# Altium project Assembly_robot.PrjPcb
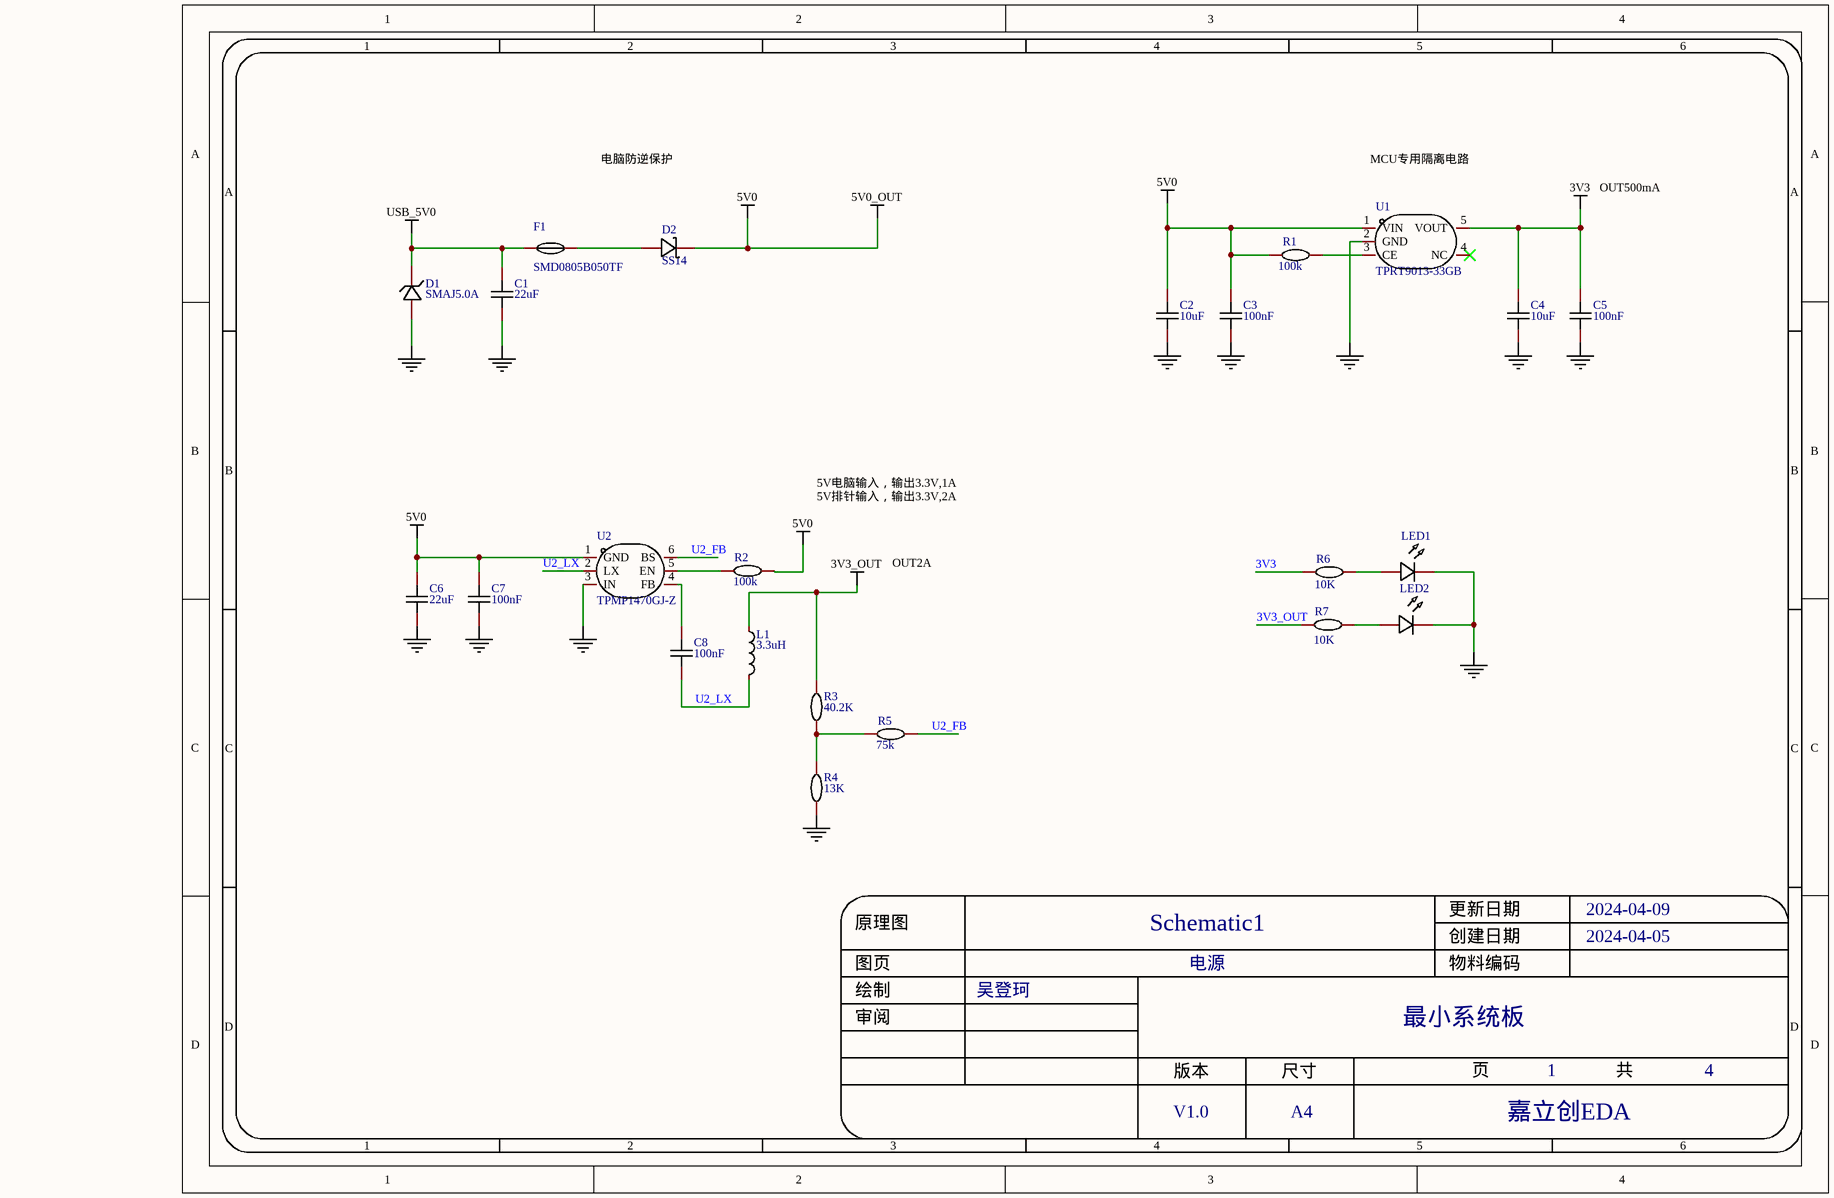
[diagram p0: 1_电源.schdoc.schdoc]
4 sheets, 130 parts. Net scope: global (net labels, ports and power ports of the same name join across sheets).
Sheets:
  1_电源.schdoc.schdoc
  2_MCU.schdoc.schdoc
  3_外设.schdoc.schdoc
  4_接口.schdoc.schdoc

## Sheet 1_电源.schdoc.schdoc
size 309 x 223 mm; Symbol: Sheet-Symbol_A4; Device: Sheet-Symbol_A4; Company: 嘉立创EDA; Drawed: 吴登珂; Version: V1.0; Page Size: A4; @Project Name: 最小系统板; @Page Count: 4; @Update Date: 2024-04-09; @Create Date: 2024-04-05; @Schematic Name: Schematic1; @Page No: 1; @Page Name: 电源

### Parts
C1  22uF  [C1206]
C2  10uF  [C0603]
C3  100nF  [C0603]
C4  10uF  [C0603]
C5  100nF  [C0603]
C6  22uF  [C1206]
C7  100nF  [C0603]
C8  100nF  [C0603]
D1  SMAJ5.0A  [SMA_L4.4-W2.8-LS5.4-RD]
D2  SS14  [SMA_L4.3-W2.6-LS5.2-RD]
F1  SMD0805B050TF  [F0805]
L1  3.3uH  [IND-SMD_L7.3-W6.6]
LED1  LED_0603-R  [LED_0603]  (value not drawn)
LED2  LED_0603-R  [LED_0603]  (value not drawn)
R1  100k  [R0603]
R2  100k  [R0603]
R3  40.2K  [R0603]
R4  13K  [R0603]
R5  75k  [R0603]
R6  10K  [R0603]
R7  10K  [R0603]
U1  TPRT9013-33GB  [SOT-23-5_L3.0-W1.7-P0.95-LS2.8-BL]
U2  TPMP1470GJ-Z  [SOT-23-6_L2.9-W1.6-P0.95-LS2.8-BL]

### Nets
3V3: C4.2 C5.2 R6.1 U1.5(VOUT)
3V3_OUT: L1.1 R3.2 R7.1
5V0: C2.2 C3.2 C6.2 C7.2 D2.1(K) R1.1 R2.2 U1.1(VIN) U2.1(GND)  [also labelled 5V0_OUT]
NetBT1_2: C1.1 C2.1 C3.1 C4.1 C5.1 C6.1 C7.1 D1.2(A) LED1.1(C) LED2.1(C) R4.1 U1.2(GND) U2.3(IN)
USB_5V0: C1.2 D1.1(C) F1.1
U2_FB: R5.2 U2.6(BS)
U2_LX: C8.2 L1.2 U2.2(LX)
NetC8_1: C8.1 U2.4(FB)
NetD2_2: D2.2(A) F1.2
NetLED1_2: LED1.2(A) R6.2
NetLED2_2: LED2.2(A) R7.2
NetR1_2: R1.2 U1.3(CE)
NetR2_1: R2.1 U2.5(EN)
NetR3_1: R3.1 R4.2 R5.1

Not connected (* = marked no-connect by the designer): U1 4(NC)*

### Notes on the sheet
- 电脑防逆保护
- MCU专用隔离电路
- OUT500mA
- 5V电脑输入，输出3.3V,1A
- 5V排针输入，输出3.3V,2A
- OUT2A
- 1
- 2
- 3
- 4
- 5
- 6
- A
- B
- C
- 原理图
- Schematic1
- 创建日期
- 更新日期
- 2024-04-09
- 2024-04-05
- 审阅
- 绘制
- 图页
- 吴登珂
- 电源
- 物料编码
- 最小系统板
- D
- 版本
- 尺寸
- 页
- 共
- V1.0
- A4
- 嘉立创EDA

### Library data of the parts
C1 C6 = CAP_1206: Symbol: CapAcitance; Convert to PCB: yes; Name: 22uF; Device: CAP_1206; Add into BOM: yes; Supplier Footprint: 1206; Value: 22uF
C2-C5 C7 C8 = CAP_0603: Symbol: CapAcitance; Convert to PCB: yes; Device: CAP_0603; Add into BOM: yes; Supplier Footprint: 0603
  C2 C4: Name: 10uF; Value: 10uF
  C3 C5 C7 C8: Name: 100nF; Value: 100nF
D1 = SMAJ5.0A_C353442: Manufacturer: 晶导微电子; Add into BOM: yes; Reverse Stand-Off Voltage (Vrwm): 5V; Maximum Clamping Voltage: 9.2V; Peak Pulse Current (Ipp)@10/1000us: 43.5A; Peak Pulse Power Dissipation (Ppp)@10/1000us: 400W; Breakdown Voltage: 6.4V; Reverse Leakage Current (Ir): 800uA; Type: TVS; Name: SMAJ5.0A; Symbol: SMAJ5.0A_C353442; Device: SMAJ5.0A_C353442; LCSC Part Name: 单向TVS 5V截止 43.5A峰值脉冲; Supplier Part: C353442; Manufacturer Part: SMAJ5.0A; Supplier Footprint: SMA; JLCPCB Part Class: 扩展库; Datasheet: https://atta.szlcsc.com/upload/public/pdf/source/20190103/C353498_9C52E1B7CA7D9691073072057BB1DA1A.pdf; Supplier: LCSC; Convert to PCB: yes
D2 = SS14_C83852: Manufacturer: onsemi(安森美); Add into BOM: yes; Forward Voltage (Vf@If): 500mV@1A; Reverse Voltage (Vr): 40V; Average Rectified Current (Io): 1A; Reverse Leakage Current (Ir): 200uA@40V; Name: SS14; Symbol: SS14_C83852; Device: SS14_C83852; Supplier: LCSC; Supplier Part: C83852; Manufacturer Part: SS14; JLCPCB Part Class: 扩展库; LCSC Part Name: 电压:40V 电流:1A; Supplier Footprint: SMA(DO-214AC); Datasheet: https://atta.szlcsc.com/upload/public/pdf/source/20181222/C83852_041FE29A925F1DAA7D9CB1F1C69076C2.pdf; Convert to PCB: yes
F1 = SMD0805B050TF: Manufacturer: Brightking(君耀电子); Add into BOM: yes; Operating Voltage (Max): 6V; Current Rating (Max): 100A; Hold Current: 500mA; Trip Current: 1A; Resistance - Initial (Ri) (Min): 150mΩ; Maximum Time to Trip: 100ms; Name: SMD0805B050TF; Symbol: SMD0805B050TF; Device: SMD0805B050TF; LCSC Part Name: 6V 500mA 0805自恢复; Supplier Part: C269104; Manufacturer Part: SMD0805B050TF; Supplier Footprint: 0805; JLCPCB Part Class: 扩展库; Datasheet: https://atta.szlcsc.com/upload/public/pdf/source/20180913/C269107_1BF28CF6F4C5BFD5B8CD673BC8D2B923.pdf; Supplier: LCSC; Convert to PCB: yes; Operating Temperature: -40℃~+85℃；-40℃~+85℃；-40℃~+85℃
L1 = MCS0630-2R2MPY1: Manufacturer: PSA(信昌电陶); Add into BOM: yes; Tolerance: ±20%; Rated Current: 8A; Saturation Current (Isat): 12A; DC Resistance (DCR): 17mΩ; Name: 3.3uH; Symbol: MCS0630-2R2MPY1; Device: MCS0630-2R2MPY1; LCSC Part Name: 2.2uH ±20% 12A; Supplier Part: C2937096; Manufacturer Part: MCS0630-2R2MPY1; Supplier Footprint: 0630; JLCPCB Part Class: 扩展库; Datasheet: https://atta.szlcsc.com/upload/public/pdf/source/20220121/EA6E6E6F70ED7BAE67EC293805EAAACB.pdf; Supplier: LCSC; Convert to PCB: yes; Value: 3.3uH
LED1 LED2 = LED_0603-R: Symbol: LED_R; Convert to PCB: yes; Device: LED_0603-R; Add into BOM: yes; Supplier Footprint: 0603
R1-R7 = Res_0603: Symbol: 电阻; Convert to PCB: yes; Device: Res_0603; Add into BOM: yes; Supplier Footprint: 0603
  R1 R2: Name: 100k; Value: 100k
  R3: Name: 40.2K; Value: 40.2K
  R4: Name: 13K; Value: 13K
  R5: Name: 75k; Value: 75k
  R6 R7: Name: 10K; Value: 10K
U1 = TPRT9013-33GB: Manufacturer: TECH PUBLIC(台舟); Add into BOM: yes; Name: TPRT9013-33GB; Symbol: TPRT9013-33GB; Device: TPRT9013-33GB; LCSC Part Name: TPRT9013-33GB; Supplier Part: C587158; Manufacturer Part: TPRT9013-33GB; Supplier Footprint: SOT-23-5; JLCPCB Part Class: 扩展库; Datasheet: https://atta.szlcsc.com/upload/public/pdf/source/20210810/692D4D0C3CF190F9330EFD28C3E572CB.pdf; Supplier: LCSC; Convert to PCB: yes; Output Type: -
U2 = TPMP1470GJ-Z: Manufacturer: TECH PUBLIC(台舟); Add into BOM: yes; Name: TPMP1470GJ-Z; Symbol: TPMP1470GJ-Z; Device: TPMP1470GJ-Z; LCSC Part Name: TPMP1470GJ-Z; Supplier Part: C558426; Manufacturer Part: TPMP1470GJ-Z; Supplier Footprint: SOT-23-6; JLCPCB Part Class: 扩展库; Datasheet: https://atta.szlcsc.com/upload/public/pdf/source/20210810/DC77DEB6764AF65BB1526AC3D213695F.pdf; Supplier: LCSC; Convert to PCB: yes

## Sheet 2_MCU.schdoc.schdoc
size 309 x 223 mm; Symbol: Sheet-Symbol_A4; Device: Sheet-Symbol_A4; Company: 嘉立创EDA; Drawed: 吴登珂; Version: V1.0; Page Size: A4; @Project Name: 最小系统板; @Page Count: 4; @Update Date: 2024-04-09; @Create Date: 2024-04-05; @Schematic Name: Schematic1; @Page No: 3; @Page Name: MCU; SheetNumber: 2; SheetTotal: 4
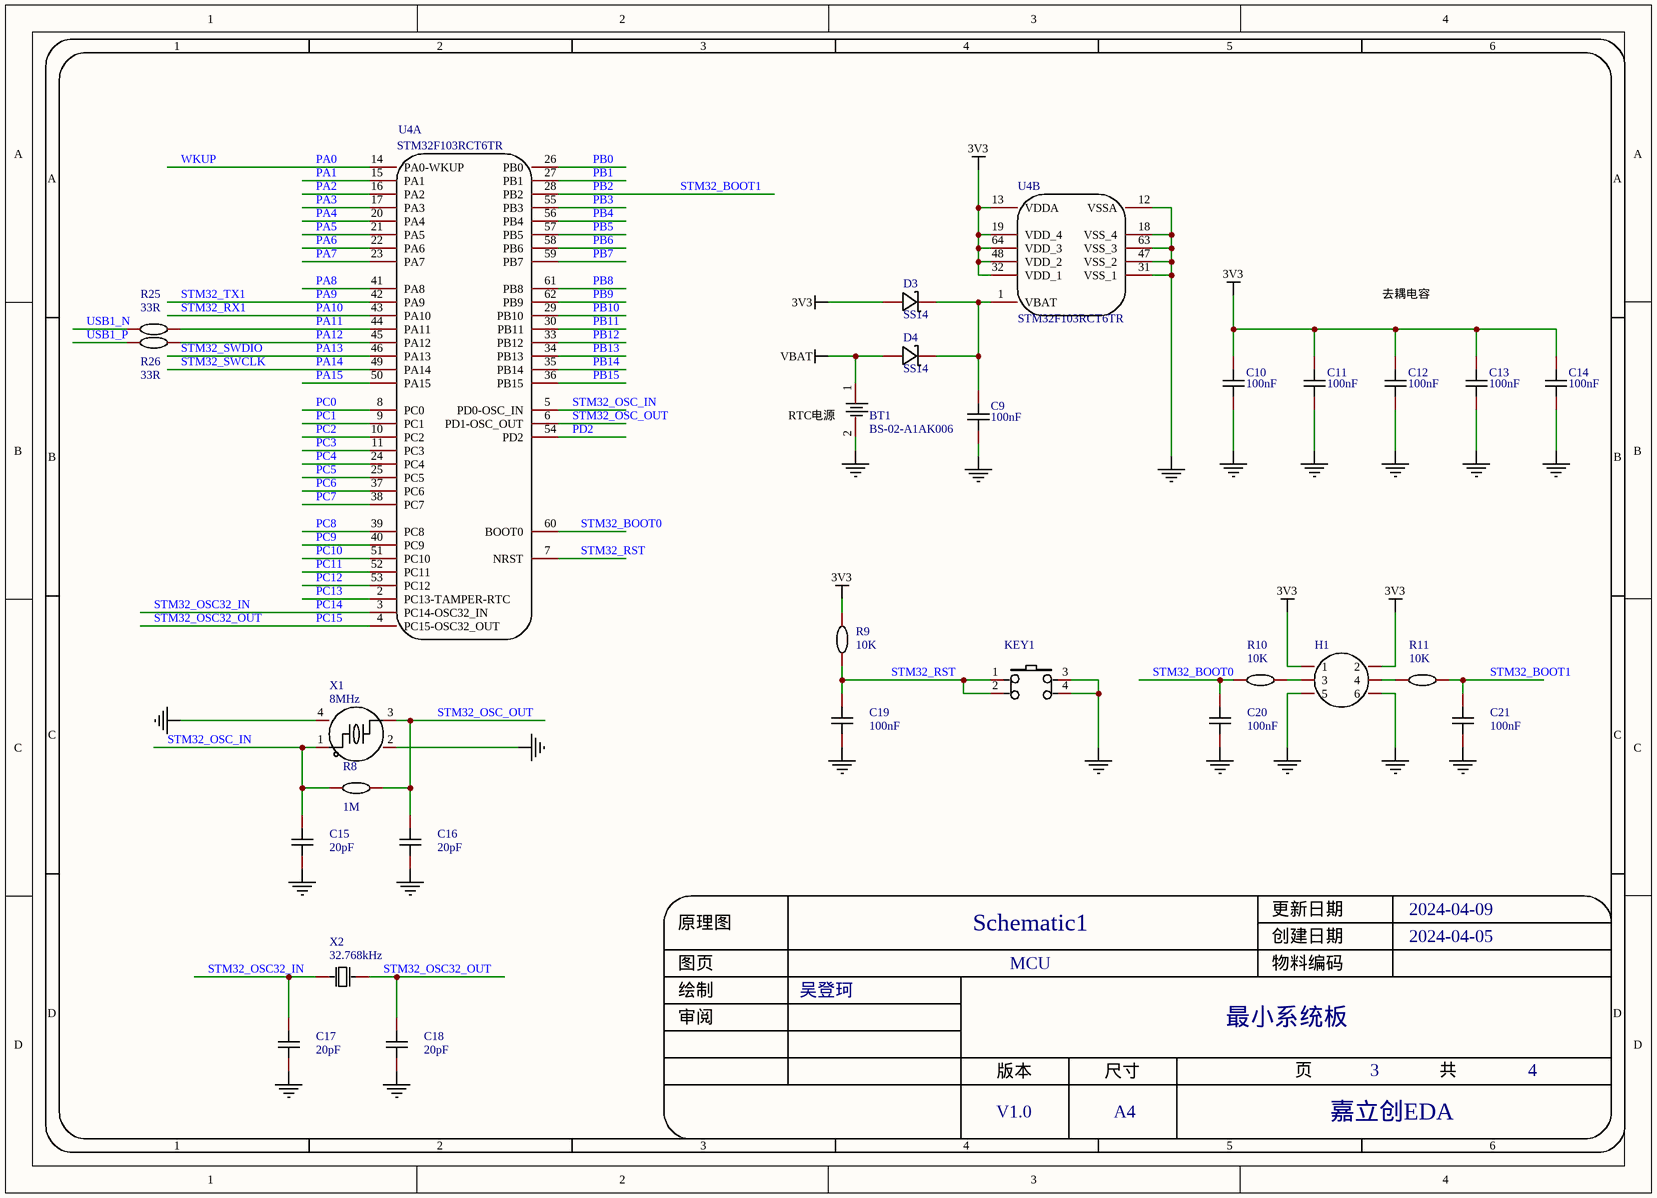
[diagram p1: 2_MCU.schdoc.schdoc]

### Parts
BT1  BS-02-A1AK006  [BAT-TH_BS-02-A1AK006]
C9  100nF  [C0603]
C10  100nF  [C0603]
C11  100nF  [C0603]
C12  100nF  [C0603]
C13  100nF  [C0603]
C14  100nF  [C0603]
C15  20pF  [C0603]
C16  20pF  [C0603]
C17  20pF  [C0603]
C18  20pF  [C0603]
C19  100nF  [C0603]
C20  100nF  [C0603]
C21  100nF  [C0603]
D3  SS14  [SMA_L4.3-W2.6-LS5.2-RD]
D4  SS14  [SMA_L4.3-W2.6-LS5.2-RD]
H1  HDR-F_2.54_2x3  [HDR-TH_6P-P2.54-V-F-R2-C3-S2.54]  (value not drawn)
KEY1  6x6x6塑料头  [SW-SMD_4P-L6.0-W6.0-P4.50-LS8.6]  (value not drawn)
R8  1M  [R0603]
R9  10K  [R0603]
R10  10K  [R0603]
R11  10K  [R0603]
R25  33R  [R0603]
R26  33R  [R0603]
U4  STM32F103RCT6TR  [LQFP-64_L10.0-W10.0-P0.50-LS12.0-BL]  (parts A,B of 2)
X1  8MHz  [OSC-SMD_4P-L3.2-W2.5-BL]
X2  32.768kHz  [OSC-SMD_L3.2-W1.5]

### Nets
3V3: C10.2 C11.2 C12.2 C13.2 C14.2 D3.2(A) H1.1 H1.2 R9.2 U4.13(VDDA) U4.19(VDD_4) U4.32(VDD_1) U4.48(VDD_2) U4.64(VDD_3)
NetBT1_2: BT1.2 C9.1 C10.1 C11.1 C12.1 C13.1 C14.1 C15.1 C16.1 C17.1 C18.1 C19.1 C20.1 C21.1 H1.5 H1.6 KEY1.3 KEY1.4 U4.12(VSSA) U4.18(VSS_4) U4.31(VSS_1) U4.47(VSS_2) U4.63(VSS_3) X1.2(GND) X1.4(GND)
VBAT: BT1.1 D4.2(A)
PA0: U4.14(PA0-WKUP)  [also labelled WKUP]
PA1: U4.15(PA1)
PA2: U4.16(PA2)
PA3: U4.17(PA3)
PA4: U4.20(PA4)
PA5: U4.21(PA5)
PA6: U4.22(PA6)
PA7: U4.23(PA7)
PA8: U4.41(PA8)
PA9: U4.42(PA9)  [also labelled STM32_TX1]
PA10: U4.43(PA10)  [also labelled STM32_RX1]
PA11: R25.2 U4.44(PA11)
PA12: R26.2 U4.45(PA12)
PA13: U4.46(PA13)  [also labelled STM32_SWDIO]
PA14: U4.49(PA14)  [also labelled STM32_SWCLK]
PA15: U4.50(PA15)
PB0: U4.26(PB0)
PB1: U4.27(PB1)
PB2: C21.2 R11.2 U4.28(PB2)  [also labelled STM32_BOOT1]
PB3: U4.55(PB3)
PB4: U4.56(PB4)
PB5: U4.57(PB5)
PB6: U4.58(PB6)
PB7: U4.59(PB7)
PB8: U4.61(PB8)
PB9: U4.62(PB9)
PB10: U4.29(PB10)
PB11: U4.30(PB11)
PB12: U4.33(PB12)
PB13: U4.34(PB13)
PB14: U4.35(PB14)
PB15: U4.36(PB15)
PC0: U4.8(PC0)
PC1: U4.9(PC1)
PC2: U4.10(PC2)
PC3: U4.11(PC3)
PC4: U4.24(PC4)
PC5: U4.25(PC5)
PC6: U4.37(PC6)
PC7: U4.38(PC7)
PC8: U4.39(PC8)
PC9: U4.40(PC9)
PC10: U4.51(PC10)
PC11: U4.52(PC11)
PC12: U4.53(PC12)
PC13: U4.2(PC13-TAMPER-RTC)
PC14: C17.2 U4.3(PC14-OSC32_IN) X2.1(OSC1)  [also labelled STM32_OSC32_IN]
PC15: C18.2 U4.4(PC15-OSC32_OUT) X2.2(OSC2)  [also labelled STM32_OSC32_OUT]
PD2: U4.54(PD2)
STM32_BOOT0: C20.2 R10.1 U4.60(BOOT0)
STM32_OSC_IN: C15.2 R8.1 U4.5(PD0-OSC_IN) X1.1
STM32_OSC_OUT: C16.2 R8.2 U4.6(PD1-OSC_OUT) X1.3
STM32_RST: C19.2 KEY1.1 KEY1.2 R9.1 U4.7(NRST)
USB1_N: R25.1
USB1_P: R26.1
NetC9_2: C9.2 D3.1(K) D4.1(K) U4.1(VBAT)
NetH1_3: H1.3 R10.2
NetH1_4: H1.4 R11.1

### Notes on the sheet
- 去耦电容
- (near BT1) RTC电源
- 1
- 2
- 3
- 4
- 5
- 6
- A
- B
- C
- 原理图
- Schematic1
- 创建日期
- 更新日期
- 2024-04-09
- 2024-04-05
- D
- 审阅
- 绘制
- 图页
- 吴登珂
- MCU
- 物料编码
- 最小系统板
- 版本
- 尺寸
- 页
- 共
- V1.0
- A4
- 嘉立创EDA

### Library data of the parts
BT1 = BS-02-A1AK006: Manufacturer: MYOUNG(美阳); Add into BOM: yes; Connector Type: 电池底座; Battery Type: CR2032; Name: BS-02-A1AK006; Symbol: BS-02-A1AK006; Device: BS-02-A1AK006; LCSC Part Name: 电池底座 适用电池:CR2032; Supplier Part: C964746; Manufacturer Part: BS-02-A1AK006; Supplier Footprint: 插件; JLCPCB Part Class: 扩展库; Datasheet: https://atta.szlcsc.com/upload/public/pdf/source/20201218/C964746_D636BD2F273EEE7B636B6EF7E90F8FC5.pdf; Supplier: LCSC; Convert to PCB: yes; Contact Plating: 锡; Operating Temperature Range: -25℃~+85℃
C9-C21 = CAP_0603: Symbol: CapAcitance; Convert to PCB: yes; Device: CAP_0603; Add into BOM: yes; Supplier Footprint: 0603
  C9-C14 C19-C21: Name: 100nF; Value: 100nF
  C15-C18: Name: 20pF; Value: 20pF
D3 D4 = SS14_C83852: as D2 on sheet 1_电源.schdoc; Name: SS14; Symbol: SS14_C83852; Device: SS14_C83852; Supplier: LCSC; Supplier Part: C83852; Manufacturer Part: SS14; JLCPCB Part Class: 扩展库; LCSC Part Name: 电压:40V 电流:1A; Supplier Footprint: SMA(DO-214AC); Datasheet: https://atta.szlcsc.com/upload/public/pdf/source/20181222/C83852_041FE29A925F1DAA7D9CB1F1C69076C2.pdf; Convert to PCB: yes
H1 = HDR-F_2.54_2x3: Symbol: HDR-F-2.54_2x3; Convert to PCB: yes; Device: HDR-F_2.54_2x3; Add into BOM: yes; Supplier Part: C92272; Supplier Footprint: 插件
KEY1 = 6x6x6塑料头: Manufacturer: 国产; Symbol: 6x6x6Plastic head; Add into BOM: yes; Switch Length: 6mm; Name: 6x6x6塑料头; Device: 6x6x6塑料头; Supplier Part: C23550; Supplier: LCSC; Manufacturer Part: 6x6x6塑料头; JLCPCB Part Class: 扩展库; LCSC Part Name: 6x6x6 塑料头; Supplier Footprint: SMD; Datasheet: https://atta.szlcsc.com/upload/public/pdf/source/20150923/1457707411939.pdf; Convert to PCB: yes; Switch Width: 6mm; Switch Height: 6mm; Mechanical Life: -
R8-R11 R25 R26 = Res_0603: Symbol: 电阻; Convert to PCB: yes; Device: Res_0603; Add into BOM: yes; Supplier Footprint: 0603
  R8: Name: 1M; Value: 1M
  R9-R11: Name: 10K; Value: 10K
  R25 R26: Name: 33R; Value: 33R
U4 = STM32F103RCT6TR: Manufacturer: ST(意法半导体); Add into BOM: yes; CPU Core: CM3; Program Storage Size: 256KB; RAM Size: 48KB; GPIO Ports Number: 51; Operating Voltage Range: 2V~3.6V; CPU Maximum Speed: 72MHz; Program Memory Type: FLASH; ADC (Bit): 12bit; Universal Serial Bus: 有; Peripheral/Function: 看门狗；DMA；看门狗；片载温度传感器; Name: STM32F103RCT6TR; Symbol: STM32F103RCT6TR; Device: STM32F103RCT6TR; LCSC Part Name: STM32F103RCT6TR; Supplier Part: C39704; Manufacturer Part: STM32F103RCT6TR; Supplier Footprint: LQFP-64(10x10); JLCPCB Part Class: 扩展库; Datasheet: https://atta.szlcsc.com/upload/public/pdf/source/20151012/1457707442737.pdf; Supplier: LCSC; Convert to PCB: yes; Operating Temperature Range: -40℃~+85℃; DAC (Bit): 12bit; PWM (Bit): -; Internal Comparator: -; communication protocol: -; Watchdog: 有; Real-Time Clock: -; Infrared Data Association: 有; Low-Voltage Detect: 有; CCP Capture/Compare: -; Secure Digital Input and Output: -; Direct Memory Access: 有; Internal Oscillator: 有
X1 = X32258MOB4SI: Manufacturer: YXC(扬兴晶振); Add into BOM: yes; Crystal Type: 贴片晶振; Normal temperature Frequency Tolerance: ±10ppm; External load capacitor: 12pF; Frequency Stability(Full temperature range): ±20ppm; Equivalent Series Resistance (ESR): 150Ω; Name: 8MHz; Symbol: X32258MOB4SI; Device: X32258MOB4SI; LCSC Part Name: 8MHz ±10ppm 12pF; Supplier Part: C2682775; Manufacturer Part: X32258MOB4SI; Supplier Footprint: SMD3225-4P; JLCPCB Part Class: 扩展库; Datasheet: https://atta.szlcsc.com/upload/public/pdf/source/20240329/19D5F850207469550BEB00D7DFEDBC7A.pdf; Supplier: LCSC; Convert to PCB: yes; Value: 8MHz; Operating Temperature: -40℃~+85℃
X2 = DST310S 32.768KHz: Manufacturer: KDS(大真空); Add into BOM: yes; Name: 32.768kHz; Symbol: DST310S 32.768KHz; Device: DST310S 32.768KHz; LCSC Part Name: 32.768KHz 12.5PF 20ppm; Supplier Part: C93232; Manufacturer Part: DST310S 32.768KHz; Supplier Footprint: SMD3215-2P; JLCPCB Part Class: 扩展库; Datasheet: https://atta.szlcsc.com/upload/public/pdf/source/20170919/C93232_1505799689477977622.pdf; Supplier: LCSC; Convert to PCB: yes; Crystal Type: -; Value: 32.768kHz; External load capacitor: -; Operating Temperature: -

## Sheet 3_外设.schdoc.schdoc
size 309 x 223 mm; Symbol: Sheet-Symbol_A4; Device: Sheet-Symbol_A4; Company: 嘉立创EDA; Drawed: 吴登珂; Version: V1.0; Page Size: A4; @Project Name: 最小系统板; @Page Count: 4; @Update Date: 2024-04-06; @Create Date: 2024-04-06; @Schematic Name: Schematic1; @Page No: 4; @Page Name: 外设
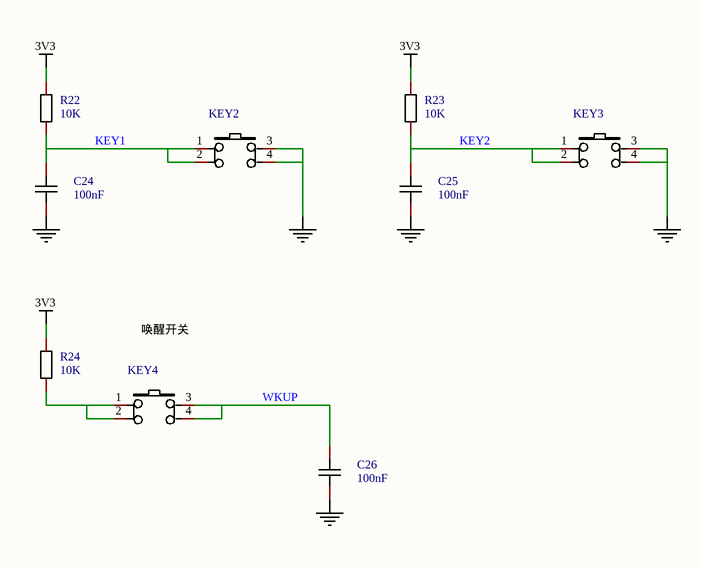
[diagram p2: 3_外设.schdoc.schdoc]

### Parts
C24  100nF  [C0603]
C25  100nF  [C0603]
C26  100nF  [C0603]
KEY2  6x6x6塑料头  [SW-SMD_4P-L6.0-W6.0-P4.50-LS8.6]  (value not drawn)
KEY3  6x6x6塑料头  [SW-SMD_4P-L6.0-W6.0-P4.50-LS8.6]  (value not drawn)
KEY4  6x6x6塑料头  [SW-SMD_4P-L6.0-W6.0-P4.50-LS8.6]  (value not drawn)
R22  10K  [R0603]
R23  10K  [R0603]
R24  10K  [R0603]

### Nets
3V3: R22.2 R23.2 R24.2
NetBT1_2: C24.1 C25.1 C26.1 KEY2.3 KEY2.4 KEY3.3 KEY3.4
KEY1: C24.2 KEY2.1 KEY2.2 R22.1
KEY2: C25.2 KEY3.1 KEY3.2 R23.1
WKUP: C26.2 KEY4.3 KEY4.4  [project net PA0]
NetKEY4_1: KEY4.1 KEY4.2 R24.1

### Notes on the sheet
- 唤醒开关
- 1
- 2
- 3
- 4
- 5
- 6
- A
- B
- C
- 原理图
- Schematic1
- 创建日期
- 更新日期
- 2024-04-06
- 审阅
- 绘制
- 图页
- 吴登珂
- 外设
- 物料编码
- 最小系统板
- D
- 版本
- 尺寸
- 页
- 共
- V1.0
- A4
- 嘉立创EDA

### Library data of the parts
C24-C26 = CAP_0603: Symbol: CapAcitance; Convert to PCB: yes; Name: 100nF; Device: CAP_0603; Add into BOM: yes; Supplier Footprint: 0603; Value: 100nF
KEY2-KEY4 = 6x6x6塑料头: Manufacturer: 国产; Symbol: 6x6x6Plastic head; Add into BOM: yes; Switch Length: 6mm; Description: 开关长度:6mm;开关宽度:6mm;开关高度:6mm;机械寿命:-;; Name: 6x6x6塑料头; Device: 6x6x6塑料头; Supplier Part: C23550; Supplier: LCSC; Manufacturer Part: 6x6x6塑料头; JLCPCB Part Class: 扩展库; LCSC Part Name: 6x6x6 塑料头; Supplier Footprint: SMD; Datasheet: https://atta.szlcsc.com/upload/public/pdf/source/20150923/1457707411939.pdf; Convert to PCB: yes; Switch Width: 6mm; Switch Height: 6mm; Mechanical Life: -
R22-R24 = Res_0603: Symbol: 电阻; Convert to PCB: yes; Name: 10K; Device: Res_0603; Add into BOM: yes; Supplier Footprint: 0603; Value: 10K

## Sheet 4_接口.schdoc.schdoc
size 309 x 223 mm; Symbol: Sheet-Symbol_A4; Device: Sheet-Symbol_A4; Company: 嘉立创EDA; Drawed: 吴登珂; Version: V1.0; Page Size: A4; @Project Name: 最小系统板; @Page Count: 4; @Update Date: 2024-04-09; @Create Date: 2024-04-05; @Schematic Name: Schematic1; @Page No: 2; @Page Name: 接口
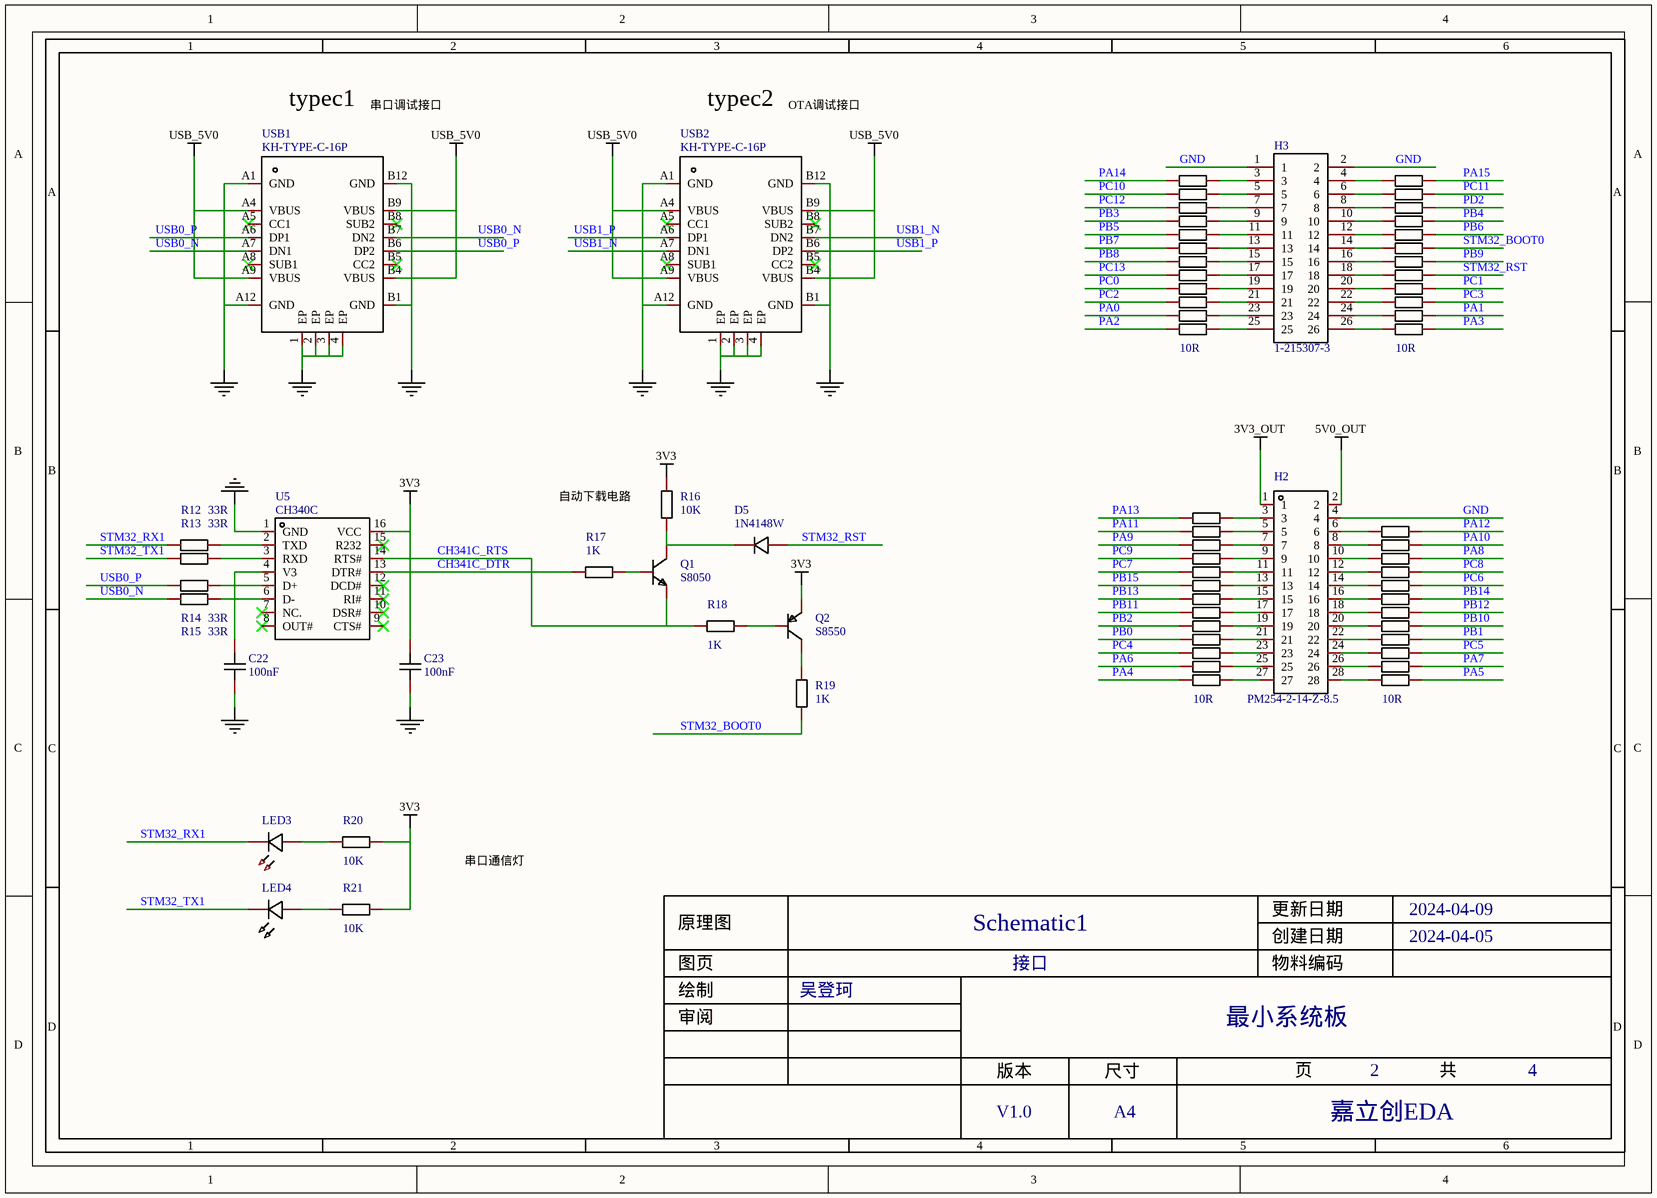
[diagram p3: 4_接口.schdoc.schdoc]

### Parts
C22  100nF  [C0603]
C23  100nF  [C0603]
D5  1N4148W  [SOD-123F_L2.7-W1.6-LS3.8-RD]
H2  PM254-2-14-Z-8.5  [HDR-TH_28P-P2.54-V-F-R2-C14-S2.54-1]
H3  1-215307-3  [HDR-TH_26P-P2.54-V-F-R2-C13-S2.54-1]
LED3  LED_0603-G  [LED_0603]  (value not drawn)
LED4  LED_0603-B  [LED_0603]  (value not drawn)
Q1  S8050  [SOT-23-3_L2.9-W1.3-P1.90-LS2.4-BR]
Q2  S8550  [SOT-23-3_L2.9-W1.6-P1.90-LS2.8-BR]
R12  33R  [R0603]
R13  33R  [R0603]
R14  33R  [R0603]
R15  33R  [R0603]
R16  10K  [R0603]
R17  1K  [R0603]
R18  1K  [R0603]
R19  1K  [R0603]
R20  10K  [R0603]
R21  10K  [R0603]
R27  10R  [R0603]  (value not drawn)
R28  10R  [R0603]  (value not drawn)
R29  10R  [R0603]  (value not drawn)
R30  10R  [R0603]  (value not drawn)
R31  10R  [R0603]  (value not drawn)
R32  10R  [R0603]  (value not drawn)
R33  10R  [R0603]  (value not drawn)
R34  10R  [R0603]  (value not drawn)
R35  10R  [R0603]  (value not drawn)
R36  10R  [R0603]  (value not drawn)
R37  10R  [R0603]  (value not drawn)
R38  10R  [R0603]
R39  10R  [R0603]  (value not drawn)
R40  10R  [R0603]  (value not drawn)
R41  10R  [R0603]  (value not drawn)
R42  10R  [R0603]  (value not drawn)
R43  10R  [R0603]  (value not drawn)
R44  10R  [R0603]  (value not drawn)
R45  10R  [R0603]  (value not drawn)
R46  10R  [R0603]  (value not drawn)
R47  10R  [R0603]  (value not drawn)
R48  10R  [R0603]  (value not drawn)
R49  10R  [R0603]  (value not drawn)
R50  10R  [R0603]
R51  10R  [R0603]  (value not drawn)
R52  10R  [R0603]  (value not drawn)
R53  10R  [R0603]  (value not drawn)
R54  10R  [R0603]  (value not drawn)
R55  10R  [R0603]  (value not drawn)
R56  10R  [R0603]  (value not drawn)
R57  10R  [R0603]  (value not drawn)
R58  10R  [R0603]  (value not drawn)
R59  10R  [R0603]  (value not drawn)
R60  10R  [R0603]  (value not drawn)
R61  10R  [R0603]  (value not drawn)
R62  10R  [R0603]  (value not drawn)
R63  10R  [R0603]
R64  10R  [R0603]
R65  10R  [R0603]  (value not drawn)
R66  10R  [R0603]  (value not drawn)
R67  10R  [R0603]  (value not drawn)
R68  10R  [R0603]  (value not drawn)
R69  10R  [R0603]  (value not drawn)
R70  10R  [R0603]  (value not drawn)
R71  10R  [R0603]  (value not drawn)
R72  10R  [R0603]  (value not drawn)
R73  10R  [R0603]  (value not drawn)
R74  10R  [R0603]  (value not drawn)
R75  10R  [R0603]  (value not drawn)
U5  CH340C  [SOP-16_L10.0-W3.9-P1.27-LS6.0-BL]
USB1  KH-TYPE-C-16P  [USB-C-SMD_KH-TYPE-C-16P]
USB2  KH-TYPE-C-16P  [USB-C-SMD_KH-TYPE-C-16P]

### Nets
3V3: C23.2 Q2.2 R16.2 R20.1 R21.1 U5.16(VCC)
3V3_OUT: H2.1
5V0_OUT: H2.2  [project net 5V0]
NetBT1_2: C22.1 C23.1 U5.1(GND) USB1.1(EP) USB1.2(EP) USB1.3(EP) USB1.4(EP) USB1.A1(GND) USB1.A12(GND) USB1.B1(GND) USB1.B12(GND) USB2.1(EP) USB2.2(EP) USB2.3(EP) USB2.4(EP) USB2.A1(GND) USB2.A12(GND) USB2.B1(GND) USB2.B12(GND)
USB_5V0: USB1.A4(VBUS) USB1.A9(VBUS) USB1.B4(VBUS) USB1.B9(VBUS) USB2.A4(VBUS) USB2.A9(VBUS) USB2.B4(VBUS) USB2.B9(VBUS)
CH341C_DTR: R17.1 U5.13(DTR#)
CH341C_RTS: Q1.2(E) R18.2 U5.14(RTS#)
GND: H2.4 H3.1 H3.2
PA0: R37.1
PA1: R49.2
PA2: R38.1
PA3: R50.2
PA4: R63.1
PA5: R64.2
PA6: R62.1
PA7: R65.2
PA8: R73.2
PA9: LED4.1(C) R13.1 R53.1  [also labelled STM32_TX1]
PA10: LED3.1(C) R12.1 R75.2  [also labelled STM32_RX1]
PA11: R52.1
PA12: R74.2
PA13: R51.1
PA14: R27.1
PA15: R39.2
PB0: R60.1
PB1: R67.2
PB2: R59.1
PB3: R30.1
PB4: R41.2
PB5: R31.1
PB6: R43.2
PB7: R32.1
PB8: R33.1
PB9: R45.2
PB10: R68.2
PB11: R58.1
PB12: R69.2
PB13: R57.1
PB14: R70.2
PB15: R56.1
PC0: R35.1
PC1: R47.2
PC2: R36.1
PC3: R48.2
PC4: R61.1
PC5: R66.2
PC6: R71.2
PC7: R55.1
PC8: R72.2
PC9: R54.1
PC10: R28.1
PC11: R40.2
PC12: R29.1
PC13: R34.1
PD2: R42.2
STM32_BOOT0: R19.1 R44.2
STM32_RST: D5.2(A) R46.2
USB0_N: R15.1 USB1.A7(DN1) USB1.B7(DN2)
USB0_P: R14.1 USB1.A6(DP1) USB1.B6(DP2)
USB1_N: USB2.A7(DN1) USB2.B7(DN2)
USB1_P: USB2.A6(DP1) USB2.B6(DP2)
NetC22_2: C22.2 U5.4(V3)
NetD5_1: D5.1(K) Q1.3(C) R16.1
NetH2_3: H2.3 R51.2
NetH2_5: H2.5 R52.2
NetH2_6: H2.6 R74.1
NetH2_7: H2.7 R53.2
NetH2_8: H2.8 R75.1
NetH2_9: H2.9 R54.2
NetH2_10: H2.10 R73.1
NetH2_11: H2.11 R55.2
NetH2_12: H2.12 R72.1
NetH2_13: H2.13 R56.2
NetH2_14: H2.14 R71.1
NetH2_15: H2.15 R57.2
NetH2_16: H2.16 R70.1
NetH2_17: H2.17 R58.2
NetH2_18: H2.18 R69.1
NetH2_19: H2.19 R59.2
NetH2_20: H2.20 R68.1
NetH2_21: H2.21 R60.2
NetH2_22: H2.22 R67.1
NetH2_23: H2.23 R61.2
NetH2_24: H2.24 R66.1
NetH2_25: H2.25 R62.2
NetH2_26: H2.26 R65.1
NetH2_27: H2.27 R63.2
NetH2_28: H2.28 R64.1
NetH3_3: H3.3 R27.2
NetH3_4: H3.4 R39.1
NetH3_5: H3.5 R28.2
NetH3_6: H3.6 R40.1
NetH3_7: H3.7 R29.2
NetH3_8: H3.8 R42.1
NetH3_9: H3.9 R30.2
NetH3_10: H3.10 R41.1
NetH3_11: H3.11 R31.2
NetH3_12: H3.12 R43.1
NetH3_13: H3.13 R32.2
NetH3_14: H3.14 R44.1
NetH3_15: H3.15 R33.2
NetH3_16: H3.16 R45.1
NetH3_17: H3.17 R34.2
NetH3_18: H3.18 R46.1
NetH3_19: H3.19 R35.2
NetH3_20: H3.20 R47.1
NetH3_21: H3.21 R36.2
NetH3_22: H3.22 R48.1
NetH3_23: H3.23 R37.2
NetH3_24: H3.24 R49.1
NetH3_25: H3.25 R38.2
NetH3_26: H3.26 R50.1
NetLED3_2: LED3.2(A) R20.2
NetLED4_2: LED4.2(A) R21.2
NetQ1_1: Q1.1(B) R17.2
NetQ2_1: Q2.1 R18.1
NetQ2_3: Q2.3 R19.2
NetR12_2: R12.2 U5.2(TXD)
NetR13_2: R13.2 U5.3(RXD)
NetR14_2: R14.2 U5.5(D+)
NetR15_2: R15.2 U5.6(D-)

Not connected (* = marked no-connect by the designer): U5 7(NC.)* 8(OUT#)* 9(CTS#)* 10(DSR#)* 11(RI#)* 12(DCD#)* 15(R232)*; USB1 A5(CC1)* A8(SUB1)* B5(CC2)* B8(SUB2)*; USB2 A5(CC1)* A8(SUB1)* B5(CC2)* B8(SUB2)*

### Notes on the sheet
- typec1
- 串口调试接口
- typec2
- OTA调试接口
- 自动下载电路
- 串口通信灯
- 1
- 2
- 3
- 4
- 5
- 6
- A
- B
- C
- 原理图
- Schematic1
- 创建日期
- 更新日期
- 2024-04-09
- 2024-04-05
- 审阅
- 绘制
- 图页
- 吴登珂
- 接口
- 物料编码
- 最小系统板
- D
- 版本
- 尺寸
- 页
- 共
- V1.0
- A4
- 嘉立创EDA

### Library data of the parts
C22 C23 = CAP_0603: Symbol: CapAcitance; Convert to PCB: yes; Name: 100nF; Device: CAP_0603; Add into BOM: yes; Supplier Footprint: 0603; Value: 100nF
D5 = 1N4148W_C81598: Manufacturer: ST(先科); Add into BOM: yes; Diode Configuration: 独立式; Forward Voltage (Vf@If): 1V@50mA; Reverse Voltage (Vr): 75V; Average Rectified Current (Io): 150mA; Power Dissipation: 400mW; Reverse Leakage Current: 1uA@75V; Reverse Recovery Time (trr): 4ns; Description: 二极管配置:独立式;正向压降(Vf):1V@50mA;直流反向耐压(Vr):75V;平均整流电流(Io):150mA;功率:400mW;反向恢复时间(trr):4ns;; Name: 1N4148W; Symbol: 1N4148W_C81598; Device: 1N4148W_C81598; Supplier: LCSC; Manufacturer Part: 1N4148W; Supplier Part: C81598; JLCPCB Part Class: 基础库; LCSC Part Name: 电压:75V 电流:150mA; Supplier Footprint: SOD-123; Datasheet: https://atta.szlcsc.com/upload/public/pdf/source/20161024/1477288446905.pdf; Convert to PCB: yes; Operating Temperature: -
H2 = PM254-2-14-Z-8.5: Manufacturer: HCTL(华灿天禄); Add into BOM: yes; Holes Structure: 2x14P; Pitch: 2.54mm; Circular Hole / Square Hole: 方孔; Number of Holes: 28P; Current Rating (Max): 3A; Holes Direction: 顶部; Soldering Temperature(Max): 260℃@5S; Description: 插孔结构:2x14P;间距:2.54mm;行距:2.54mm;圆孔/方孔:方孔;安装类型:直插;排数:双排;总孔位数:28P;额定电流:3A;额定电压:-;插孔方向:顶部;塑高:8.5mm;触头材质:铜合金;工作温度范围:-40℃~+105℃;焊接温度(最大值):260℃@5S;; Name: PM254-2-14-Z-8.5; Symbol: PM254-2-14-Z-8.5; Device: PM254-2-14-Z-8.5; LCSC Part Name: 2x14P 间距:2.54mm 直插; Supplier Part: C2897415; Manufacturer Part: PM254-2-14-Z-8.5; Supplier Footprint: 插件,P=2.54mm; JLCPCB Part Class: 扩展库; Datasheet: https://atta.szlcsc.com/upload/public/pdf/source/20230609/3D36CA2C1BFC9FD1C3F709AD9DFEB9C2.pdf; Supplier: LCSC; Convert to PCB: yes; Row Spacing: 2.54mm; Mounting Type: 直插; Number of Rows: 双排; Voltage Rating (Max): -; Insulation Height: 8.5mm; Contact Material: 铜合金; Operating Temperature Range: -40℃~+105℃
H3 = 1-215307-3: Manufacturer: TE Connectivity(泰科电子); Add into BOM: yes; Holes Structure: 2x13P; Pitch: 2.54mm; Number of Holes: 26P; Description: 插孔结构:2x13P;间距:2.54mm;行距:2.54mm;安装类型:直插;排数:双排;总孔位数:26P;塑高:7mm;触头材质:磷青铜;触头镀层:锡;; Name: 1-215307-3; Symbol: 1-215307-3; Device: 1-215307-3; LCSC Part Name: 间距:2.54mm 2x13P 直插; Supplier Part: C306162; Manufacturer Part: 1-215307-3; Supplier Footprint: 插件,P=2.54mm; JLCPCB Part Class: 扩展库; Datasheet: https://atta.szlcsc.com/upload/public/pdf/source/20181106/C306162_A5692CDC64CD04F4B4B72A14E7600F8F.pdf; Supplier: LCSC; Convert to PCB: yes; Row Spacing: 2.54mm; Mounting Type: 直插; Number of Rows: 双排; Insulation Height: 7mm; Contact Material: 磷青铜; Contact Plating: 锡
LED3 = LED_0603-G: Symbol: LED_G; Convert to PCB: yes; Device: LED_0603-G; Add into BOM: yes; Supplier Footprint: 0603
LED4 = LED_0603-B: Symbol: LED_B; Convert to PCB: yes; Device: LED_0603-B; Add into BOM: yes; Supplier Footprint: 0603
Q1 = S8050: Manufacturer: Doeshare(德芯); Symbol: S8050_C2931719; Add into BOM: yes; Description: NPN 25V 500mA 120-400 SOT-23; Name: S8050; Device: S8050; LCSC Part Name: S8050; Supplier Part: C2931719; Manufacturer Part: S8050; Supplier Footprint: SOT-23; JLCPCB Part Class: 扩展库; Datasheet: https://atta.szlcsc.com/upload/public/pdf/source/20220117/E6D3315E0D6ADDB25840BFFAC039C5C0.pdf; Supplier: LCSC; Convert to PCB: yes
Q2 = S8550_C105432: Manufacturer: CJ(江苏长电/长晶); Add into BOM: yes; Transistor Type: PNP; Collector Current (Ic): 500mA; Collector-Emitter Breakdown Voltage (Vceo): 25V; Power Dissipation (Pd): 300mW; DC Current Gain (hFE@Ic,Vce): 120@50mA,1V; Transition Frequency (fT): 150MHz; Collector Cut-Off Current (Icbo): 100nA; Collector-Emitter Saturation Voltage (VCE(sat)@Ic,Ib): 600mV@500mA,50mA; Description: 晶体管类型:PNP;集电极电流(Ic):500mA;集射极击穿电压(Vceo):25V;功率(Pd):300mW;直流电流增益(hFE@Ic,Vce):120@50mA,1V;; Name: S8550; Symbol: S8550_C105432; Device: S8550_C105432; LCSC Part Name: S8550(RANGE:120-200) L档120-200; Supplier Part: C105432; Manufacturer Part: S8550; Supplier Footprint: SOT-23; JLCPCB Part Class: 基础库; Datasheet: https://atta.szlcsc.com/upload/public/pdf/source/20171228/C164891_15144412930301213894.pdf; Supplier: LCSC; Convert to PCB: yes; Operating Temperature: -
R12-R21 R27-R75 = Res_0603: Symbol: 电阻; Convert to PCB: yes; Device: Res_0603; Add into BOM: yes; Supplier Footprint: 0603
  R12-R15: Name: 33R; Value: 33R
  R16 R20 R21: Name: 10K; Value: 10K
  R17-R19: Name: 1K; Value: 1K
  R27-R75: Name: 10R; Value: 10R
U5 = CH340C: Manufacturer: WCH(南京沁恒); Add into BOM: yes; Applications Function: 收发器; Protocol: USB 2.0; Supply Voltage: 3.3V；5V; Data Rate: 2Mbps; Description: 应用功能:收发器;接口协议:USB 2.0;数据速率:2Mbps;; Name: CH340C; Symbol: CH340C; Device: CH340C; Supplier: LCSC; Manufacturer Part: CH340C; Supplier Part: C84681; JLCPCB Part Class: 扩展库; LCSC Part Name: CH340C USB转串口芯片 CH340; Supplier Footprint: SOP-16; Datasheet: https://atta.szlcsc.com/upload/public/pdf/source/20200819/C84681_ADBED554CE321879DBD6B1D06488689C.pdf; Convert to PCB: yes
USB1 USB2 = KH-TYPE-C-16P: Manufacturer: kinghelm(金航标); Add into BOM: yes; Connector Type: Type-C; Gender: 母; Number of Ports: 1; Number of Contacts: 16P; Current Rating - Power (Max): 3A; Description: 连接器类型:Type-C;标准:-;公母:母;端口数量:1;触点数量:16P;安装方式:卧贴;额定电流 - 电源:3A;工作温度范围:-40℃~+85℃;; Name: KH-TYPE-C-16P; Symbol: KH-TYPE-C-16P; Device: KH-TYPE-C-16P; LCSC Part Name: Type-C 母 卧贴; Supplier Part: C709357; Manufacturer Part: KH-TYPE-C-16P; Supplier Footprint: SMD; JLCPCB Part Class: 扩展库; Datasheet: https://atta.szlcsc.com/upload/public/pdf/source/20200911/C709357_AA8DCEB38BB20E3035A7ED7AE7667837.pdf; Supplier: LCSC; Convert to PCB: yes; Standard: -; Mounting Style: 卧贴; Operating Temperature Range: -40℃~+85℃

## Nets that join several sheets
3V3: 1_电源.schdoc (C4.2 C5.2 R6.1 U1.5), 2_MCU.schdoc (14 pins), 3_外设.schdoc (R22.2 R23.2 R24.2), 4_接口.schdoc (6 pins)
3V3_OUT: 1_电源.schdoc (L1.1 R3.2 R7.1), 4_接口.schdoc (H2.1)
5V0: 1_电源.schdoc (9 pins), 4_接口.schdoc (H2.2)
NetBT1_2: 1_电源.schdoc (13 pins), 2_MCU.schdoc (25 pins), 3_外设.schdoc (7 pins), 4_接口.schdoc (19 pins)
USB_5V0: 1_电源.schdoc (C1.2 D1.1 F1.1), 4_接口.schdoc (8 pins)
PA0: 2_MCU.schdoc (U4.14), 3_外设.schdoc (C26.2 KEY4.3 KEY4.4), 4_接口.schdoc (R37.1)
PA1: 2_MCU.schdoc (U4.15), 4_接口.schdoc (R49.2)
PA2: 2_MCU.schdoc (U4.16), 4_接口.schdoc (R38.1)
PA3: 2_MCU.schdoc (U4.17), 4_接口.schdoc (R50.2)
PA4: 2_MCU.schdoc (U4.20), 4_接口.schdoc (R63.1)
PA5: 2_MCU.schdoc (U4.21), 4_接口.schdoc (R64.2)
PA6: 2_MCU.schdoc (U4.22), 4_接口.schdoc (R62.1)
PA7: 2_MCU.schdoc (U4.23), 4_接口.schdoc (R65.2)
PA8: 2_MCU.schdoc (U4.41), 4_接口.schdoc (R73.2)
PA9: 2_MCU.schdoc (U4.42), 4_接口.schdoc (LED4.1 R13.1 R53.1)
PA10: 2_MCU.schdoc (U4.43), 4_接口.schdoc (LED3.1 R12.1 R75.2)
PA11: 2_MCU.schdoc (R25.2 U4.44), 4_接口.schdoc (R52.1)
PA12: 2_MCU.schdoc (R26.2 U4.45), 4_接口.schdoc (R74.2)
PA13: 2_MCU.schdoc (U4.46), 4_接口.schdoc (R51.1)
PA14: 2_MCU.schdoc (U4.49), 4_接口.schdoc (R27.1)
PA15: 2_MCU.schdoc (U4.50), 4_接口.schdoc (R39.2)
PB0: 2_MCU.schdoc (U4.26), 4_接口.schdoc (R60.1)
PB1: 2_MCU.schdoc (U4.27), 4_接口.schdoc (R67.2)
PB2: 2_MCU.schdoc (C21.2 R11.2 U4.28), 4_接口.schdoc (R59.1)
PB3: 2_MCU.schdoc (U4.55), 4_接口.schdoc (R30.1)
PB4: 2_MCU.schdoc (U4.56), 4_接口.schdoc (R41.2)
PB5: 2_MCU.schdoc (U4.57), 4_接口.schdoc (R31.1)
PB6: 2_MCU.schdoc (U4.58), 4_接口.schdoc (R43.2)
PB7: 2_MCU.schdoc (U4.59), 4_接口.schdoc (R32.1)
PB8: 2_MCU.schdoc (U4.61), 4_接口.schdoc (R33.1)
PB9: 2_MCU.schdoc (U4.62), 4_接口.schdoc (R45.2)
PB10: 2_MCU.schdoc (U4.29), 4_接口.schdoc (R68.2)
PB11: 2_MCU.schdoc (U4.30), 4_接口.schdoc (R58.1)
PB12: 2_MCU.schdoc (U4.33), 4_接口.schdoc (R69.2)
PB13: 2_MCU.schdoc (U4.34), 4_接口.schdoc (R57.1)
PB14: 2_MCU.schdoc (U4.35), 4_接口.schdoc (R70.2)
PB15: 2_MCU.schdoc (U4.36), 4_接口.schdoc (R56.1)
PC0: 2_MCU.schdoc (U4.8), 4_接口.schdoc (R35.1)
PC1: 2_MCU.schdoc (U4.9), 4_接口.schdoc (R47.2)
PC2: 2_MCU.schdoc (U4.10), 4_接口.schdoc (R36.1)
PC3: 2_MCU.schdoc (U4.11), 4_接口.schdoc (R48.2)
PC4: 2_MCU.schdoc (U4.24), 4_接口.schdoc (R61.1)
PC5: 2_MCU.schdoc (U4.25), 4_接口.schdoc (R66.2)
PC6: 2_MCU.schdoc (U4.37), 4_接口.schdoc (R71.2)
PC7: 2_MCU.schdoc (U4.38), 4_接口.schdoc (R55.1)
PC8: 2_MCU.schdoc (U4.39), 4_接口.schdoc (R72.2)
PC9: 2_MCU.schdoc (U4.40), 4_接口.schdoc (R54.1)
PC10: 2_MCU.schdoc (U4.51), 4_接口.schdoc (R28.1)
PC11: 2_MCU.schdoc (U4.52), 4_接口.schdoc (R40.2)
PC12: 2_MCU.schdoc (U4.53), 4_接口.schdoc (R29.1)
PC13: 2_MCU.schdoc (U4.2), 4_接口.schdoc (R34.1)
PD2: 2_MCU.schdoc (U4.54), 4_接口.schdoc (R42.2)
STM32_BOOT0: 2_MCU.schdoc (C20.2 R10.1 U4.60), 4_接口.schdoc (R19.1 R44.2)
STM32_RST: 2_MCU.schdoc (5 pins), 4_接口.schdoc (D5.2 R46.2)
USB1_N: 2_MCU.schdoc (R25.1), 4_接口.schdoc (USB2.A7 USB2.B7)
USB1_P: 2_MCU.schdoc (R26.1), 4_接口.schdoc (USB2.A6 USB2.B6)